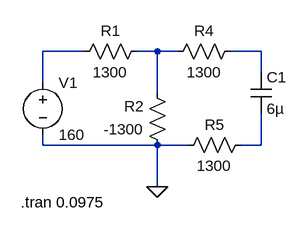
[diagram p0: schematic Draft2.asc]
Draft2.asc, the LTspice schematic file:
Version 4
SHEET 1 880 680
WIRE 128 80 64 80
WIRE 240 80 208 80
WIRE 272 80 240 80
WIRE 400 80 352 80
WIRE 400 112 400 80
WIRE 64 128 64 80
WIRE 240 144 240 80
WIRE 64 224 64 208
WIRE 240 224 64 224
WIRE 288 224 240 224
WIRE 400 224 400 176
WIRE 400 224 368 224
WIRE 240 288 240 224
FLAG 240 288 0
DATAFLAG 224 80 ""
SYMBOL res 224 64 R90
WINDOW 0 0 56 VBottom 2
WINDOW 3 32 56 VTop 2
SYMATTR InstName R1
SYMATTR Value 1300
SYMBOL res 256 240 R180
WINDOW 0 36 76 Left 2
WINDOW 3 36 40 Left 2
SYMATTR InstName R2
SYMATTR Value -1300
SYMBOL res 256 96 R270
WINDOW 0 32 56 VTop 2
WINDOW 3 0 56 VBottom 2
SYMATTR InstName R4
SYMATTR Value 1300
SYMBOL res 272 240 R270
WINDOW 0 32 56 VTop 2
WINDOW 3 0 56 VBottom 2
SYMATTR InstName R5
SYMATTR Value 1300
SYMBOL cap 384 112 R0
SYMATTR InstName C1
SYMATTR Value 6µ
SYMBOL voltage 64 112 R0
SYMATTR InstName V1
SYMATTR Value 160
TEXT 30 312 Left 2 !.tran 0.0975

The netlist it stands for:
* Draft2.asc
R1 N002 N001 1300
R2 0 N002 -1300
R4 N002 N003 1300
R5 0 N004 1300
C1 N003 N004 6µ
V1 N001 0 160
.tran 0.0975
.backanno
.end